# EAGLE design Minimal (EAGLE 9.4.2)

## Sheet 1 of 2
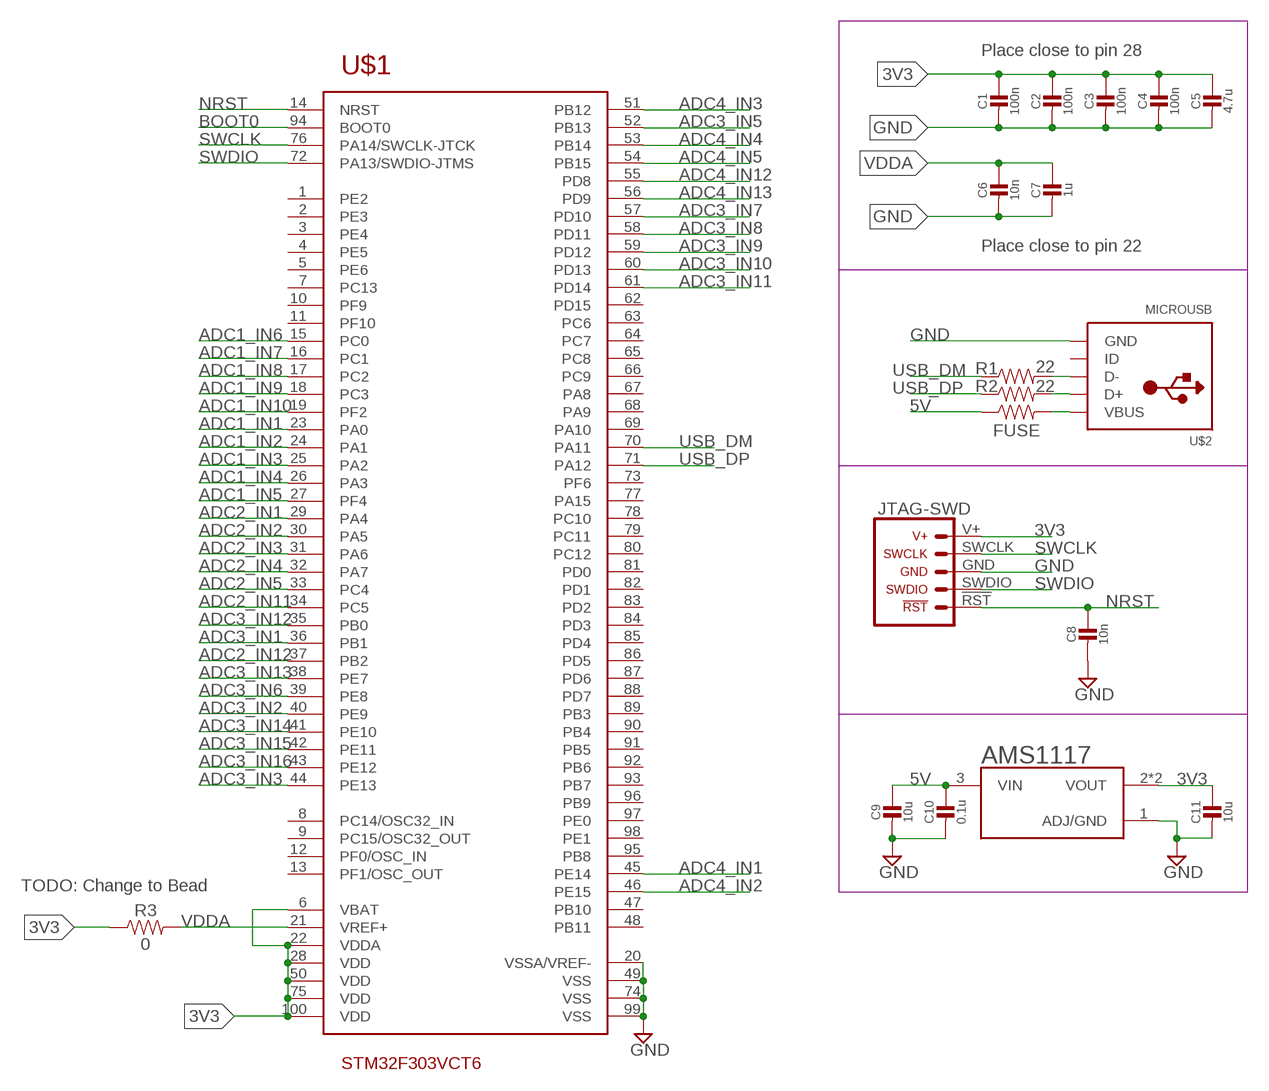
[diagram p0: schematic, sheet 1]

### Parts
AMS1117  3.3V  VREG_AMS1117SMALL  [SOT89]
C1  100n  CAP_CERAMIC_0603  [CAP_0603]
C2  100n  CAP_CERAMIC_0603  [CAP_0603]
C3  100n  CAP_CERAMIC_0603  [CAP_0603]
C4  100n  CAP_CERAMIC_0603  [CAP_0603]
C5  4.7u  CAP_CERAMIC_0603  [CAP_0603]
C6  10n  CAP_CERAMIC_0603  [CAP_0603]
C7  1u  CAP_CERAMIC_0603  [CAP_0603]
C8  10n  CAP_CERAMIC_0603  [CAP_0603]
C9  10u  CAP_CERAMIC_0603  [CAP_0603]
C10  0.1u  CAP_CERAMIC_0603  [CAP_0603]
C11  10u  CAP_CERAMIC_0603  [CAP_0603]
FUSE  RESISTOR1206  [1206]
R1  22  RESISTOR0603  [0603]
R2  22  RESISTOR0603  [0603]
R3  0  RESISTOR0603  [0603]
U$1  STM32F303VCT6  [LQFP-100]
U$2  MICROUSB  [MICROUSB]
U$3  JTAG-SWD  [JTAG_SWD]

### Nets
3V3: AMS1117.2(VOUT) AMS1117.2@1(VOUT) C1.1 C2.1 C3.1 C4.1 C5.1 C11.1 R3.1 U$1.6(VBAT) U$1.22(VDDA) U$1.28(VDD) U$1.50(VDD) U$1.75(VDD) U$1.100(VDD) U$3.V+
5V: AMS1117.3(VIN) C9.1 C10.1 FUSE.1
ADC1_IN1: U$1.23(PA0) ; also sheet 2
ADC1_IN2: U$1.24(PA1) ; also sheet 2
ADC1_IN3: U$1.25(PA2) ; also sheet 2
ADC1_IN4: U$1.26(PA3) ; also sheet 2
ADC1_IN5: U$1.27(PF4) ; also sheet 2
ADC1_IN6: U$1.15(PC0) ; also sheet 2
ADC1_IN7: U$1.16(PC1) ; also sheet 2
ADC1_IN8: U$1.17(PC2) ; also sheet 2
ADC1_IN9: U$1.18(PC3) ; also sheet 2
ADC1_IN10: U$1.19(PF2) ; also sheet 2
ADC2_IN1: U$1.29(PA4) ; also sheet 2
ADC2_IN2: U$1.30(PA5) ; also sheet 2
ADC2_IN3: U$1.31(PA6) ; also sheet 2
ADC2_IN4: U$1.32(PA7) ; also sheet 2
ADC2_IN5: U$1.33(PC4) ; also sheet 2
ADC2_IN11: U$1.34(PC5) ; also sheet 2
ADC2_IN12: U$1.37(PB2) ; also sheet 2
ADC3_IN1: U$1.36(PB1) ; also sheet 2
ADC3_IN2: U$1.40(PE9) ; also sheet 2
ADC3_IN3: U$1.44(PE13) ; also sheet 2
ADC3_IN5: U$1.52(PB13) ; also sheet 2
ADC3_IN6: U$1.39(PE8) ; also sheet 2
ADC3_IN7: U$1.57(PD10) ; also sheet 2
ADC3_IN8: U$1.58(PD11) ; also sheet 2
ADC3_IN9: U$1.59(PD12) ; also sheet 2
ADC3_IN10: U$1.60(PD13) ; also sheet 2
ADC3_IN11: U$1.61(PD14) ; also sheet 2
ADC3_IN12: U$1.35(PB0) ; also sheet 2
ADC3_IN13: U$1.38(PE7) ; also sheet 2
ADC3_IN14: U$1.41(PE10) ; also sheet 2
ADC3_IN15: U$1.42(PE11) ; also sheet 2
ADC3_IN16: U$1.43(PE12) ; also sheet 2
ADC4_IN1: U$1.45(PE14) ; also sheet 2
ADC4_IN2: U$1.46(PE15) ; also sheet 2
ADC4_IN3: U$1.51(PB12) ; also sheet 2
ADC4_IN4: U$1.53(PB14) ; also sheet 2
ADC4_IN5: U$1.54(PB15) ; also sheet 2
ADC4_IN12: U$1.55(PD8) ; also sheet 2
ADC4_IN13: U$1.56(PD9) ; also sheet 2
BOOT0: U$1.94(BOOT0)
GND: AMS1117.1(ADJ/GND) C1.2 C2.2 C3.2 C4.2 C5.2 C6.2 C7.2 C8.2 C9.2 C10.2 C11.2 U$1.20(VSSA/VREF-) U$1.49(VSS) U$1.74(VSS) U$1.99(VSS) U$2.GND U$2.S1(GND) U$2.S2(GND) U$2.S3(GND) U$2.S4(GND) U$2.S5(GND) U$2.S6(GND) U$3.GND
N$1: FUSE.2 U$2.VBUS
N$2: R2.2 U$2.D+
N$3: R1.2 U$2.D-
NRST: C8.1 U$1.14(NRST) U$3.!RST
SWCLK: U$1.76(PA14/SWCLK-JTCK) U$3.SWCLK
SWDIO: U$1.72(PA13/SWDIO-JTMS) U$3.SWDIO
USB_DM: R1.1 U$1.70(PA11)
USB_DP: R2.1 U$1.71(PA12)
VDDA: C6.1 C7.1 R3.2 U$1.21(VREF+)
Unconnected: U$1.1(PE2) U$1.2(PE3) U$1.3(PE4) U$1.4(PE5) U$1.5(PE6) U$1.7(PC13) U$1.8(PC14/OSC32_IN) U$1.9(PC15/OSC32_OUT) U$1.10(PF9) U$1.11(PF10) U$1.12(PF0/OSC_IN) U$1.13(PF1/OSC_OUT) U$1.47(PB10) U$1.48(PB11) U$1.62(PD15) U$1.63(PC6) U$1.64(PC7) U$1.65(PC8) U$1.66(PC9) U$1.67(PA8) U$1.68(PA9) U$1.69(PA10) U$1.73(PF6) U$1.77(PA15) U$1.78(PC10) U$1.79(PC11) U$1.80(PC12) U$1.81(PD0) U$1.82(PD1) U$1.83(PD2) U$1.84(PD3) U$1.85(PD4) U$1.86(PD5) U$1.87(PD6) U$1.88(PD7) U$1.89(PB3) U$1.90(PB4) U$1.91(PB5) U$1.92(PB6) U$1.93(PB7) U$1.95(PB8) U$1.96(PB9) U$1.97(PE0) U$1.98(PE1) U$2.ID

### Notes on the sheet
- Place close to pin 28
- Place close to pin 22
- TODO: Change to Bead

## Sheet 2 of 2
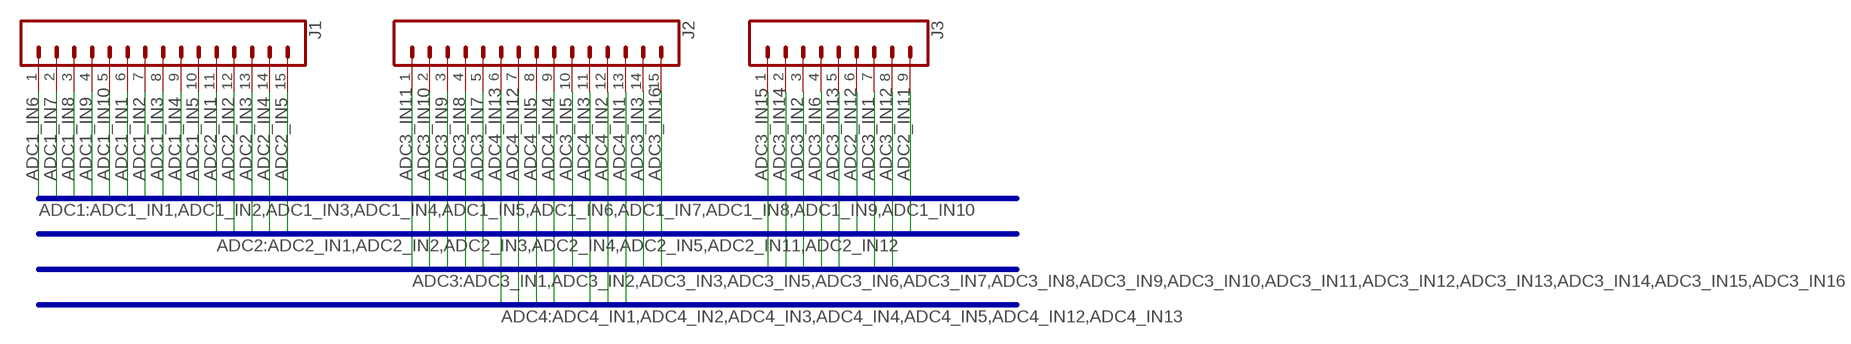
[diagram p1: schematic, sheet 2]

### Parts
J1  CONN_15  [1X15]
J2  CONN_15  [1X15]
J3  CONN_09  [1X09]

### Nets
ADC1_IN1: J1.6 ; also sheet 1
ADC1_IN2: J1.7 ; also sheet 1
ADC1_IN3: J1.8 ; also sheet 1
ADC1_IN4: J1.9 ; also sheet 1
ADC1_IN5: J1.10 ; also sheet 1
ADC1_IN6: J1.1 ; also sheet 1
ADC1_IN7: J1.2 ; also sheet 1
ADC1_IN8: J1.3 ; also sheet 1
ADC1_IN9: J1.4 ; also sheet 1
ADC1_IN10: J1.5 ; also sheet 1
ADC2_IN1: J1.11 ; also sheet 1
ADC2_IN2: J1.12 ; also sheet 1
ADC2_IN3: J1.13 ; also sheet 1
ADC2_IN4: J1.14 ; also sheet 1
ADC2_IN5: J1.15 ; also sheet 1
ADC2_IN11: J3.9 ; also sheet 1
ADC2_IN12: J3.6 ; also sheet 1
ADC3_IN1: J3.7 ; also sheet 1
ADC3_IN2: J3.3 ; also sheet 1
ADC3_IN3: J2.14 ; also sheet 1
ADC3_IN5: J2.10 ; also sheet 1
ADC3_IN6: J3.4 ; also sheet 1
ADC3_IN7: J2.5 ; also sheet 1
ADC3_IN8: J2.4 ; also sheet 1
ADC3_IN9: J2.3 ; also sheet 1
ADC3_IN10: J2.2 ; also sheet 1
ADC3_IN11: J2.1 ; also sheet 1
ADC3_IN12: J3.8 ; also sheet 1
ADC3_IN13: J3.5 ; also sheet 1
ADC3_IN14: J3.2 ; also sheet 1
ADC3_IN15: J3.1 ; also sheet 1
ADC3_IN16: J2.15 ; also sheet 1
ADC4_IN1: J2.13 ; also sheet 1
ADC4_IN2: J2.12 ; also sheet 1
ADC4_IN3: J2.11 ; also sheet 1
ADC4_IN4: J2.9 ; also sheet 1
ADC4_IN5: J2.8 ; also sheet 1
ADC4_IN12: J2.7 ; also sheet 1
ADC4_IN13: J2.6 ; also sheet 1

### Buses
ADC1:ADC1_IN1,ADC1_IN2,ADC1_IN3,ADC1_IN4,ADC1_IN5,ADC1_IN6,ADC1_IN7,ADC1_IN8,ADC1_IN9,ADC1_IN10
ADC2:ADC2_IN1,ADC2_IN2,ADC2_IN3,ADC2_IN4,ADC2_IN5,ADC2_IN11,ADC2_IN12
ADC3:ADC3_IN1,ADC3_IN2,ADC3_IN3,ADC3_IN5,ADC3_IN6,ADC3_IN7,ADC3_IN8,ADC3_IN9,ADC3_IN10,ADC3_IN11,ADC3_IN12,ADC3_IN13,ADC3_IN14,ADC3_IN15,ADC3_IN16
ADC4:ADC4_IN1,ADC4_IN2,ADC4_IN3,ADC4_IN4,ADC4_IN5,ADC4_IN12,ADC4_IN13

## Library data of the parts
AMS1117 = Scott-ICs:VREG_AMS1117: 1-Amp Low Drop Out Voltage Regulatator
C1-C11 = Scott-Electrical:CAP_CERAMIC
FUSE R1-R3 = Scott-Electrical:RESISTOR: Generic Resistor Package
J1 J2 = SparkFun-Connectors:CONN_15: Multi connection point. Often used as Generic Header-pin footprint for 0.1 inch spaced/style header connections On any of the 0.1 inch spaced packages, you can populate with these: Break Away Headers - Straight <https://www.sparkfun.com/products/116> (PRT-00116) Break Away Male Headers - Right Angle <https://www.sparkfun.com/products/553> (PRT-00553) Female Headers <https://www.sparkfun.com/products/115> (PRT-00115) Break Away Headers - Machine Pin <https://www.sparkfun.com/products/117> (PRT-00117) Break Away Female Headers - Swiss Machine Pin <https://www.sparkfun.com/products/743> (PRT-00743) For SCREWTERMINALS and SPRING TERMINALS visit here: Screw Terimnals on SparkFun.com <https://www.sparkfun.com/search/results?term=Screw+Terminals> (5mm/3.5mm/2.54mm spacing) This device is also useful as a general connection point to wire up your design to another part of your project. Our various solder wires solder well into these plated through hole pads. Hook-Up Wire - Assortment (Stranded, 22 AWG) <https://www.sparkfun.com/products/11375> (PRT-11375) Hook-Up Wire - Assortment (Solid Core, 22 AWG) <https://www.sparkfun.com/products/11367> (PRT-11367) View the entire wire category on our website here <https://www.sparkfun.com/categories/141> Special notes: Molex polarized connector foot print use with SKU : PRT-08231 with associated crimp pins and housings. 1MM SMD Version SKU: PRT-10208 NOTES ON THE VARIANTS LOCK and LOCK_LONGPADS... This footprint was designed to help hold the alignment of a through-hole component (i.e. 6-pin header) while soldering it into place. You may notice that each hole has been shifted either up or down by 0.005 of an inch from it's more standard position (which is a perfectly straight line). This slight alteration caused the pins (the squares in the middle) to touch the edges of the holes. Because they are alternating, it causes a "brace" to hold the component in place. 0.005 has proven to be the perfect amount of "off-center" position when using our standard breakaway headers. Although looks a little odd when you look at the bare footprint, once you have a header in there, the alteration is very hard to notice. Also,if you push a header all the way into place, it is covered up entirely on the bottom side.
J3 = SparkFun-Connectors:CONN_09: Multi connection point. Often used as Generic Header-pin footprint for 0.1 inch spaced/style header connections On any of the 0.1 inch spaced packages, you can populate with these: Break Away Headers - Straight <https://www.sparkfun.com/products/116> (PRT-00116) Break Away Male Headers - Right Angle <https://www.sparkfun.com/products/553> (PRT-00553) Female Headers <https://www.sparkfun.com/products/115> (PRT-00115) Break Away Headers - Machine Pin <https://www.sparkfun.com/products/117> (PRT-00117) Break Away Female Headers - Swiss Machine Pin <https://www.sparkfun.com/products/743> (PRT-00743) For SCREWTERMINALS and SPRING TERMINALS visit here: Screw Terimnals on SparkFun.com <https://www.sparkfun.com/search/results?term=Screw+Terminals> (5mm/3.5mm/2.54mm spacing) This device is also useful as a general connection point to wire up your design to another part of your project. Our various solder wires solder well into these plated through hole pads. Hook-Up Wire - Assortment (Stranded, 22 AWG) <https://www.sparkfun.com/products/11375> (PRT-11375) Hook-Up Wire - Assortment (Solid Core, 22 AWG) <https://www.sparkfun.com/products/11367> (PRT-11367) View the entire wire category on our website here <https://www.sparkfun.com/categories/141> Special notes: Molex polarized connector foot print use with SKU : PRT-08231 with associated crimp pins and housings. 1MM SMD Version SKU: PRT-10208 NOTES ON THE VARIANTS LOCK and LOCK_LONGPADS... This footprint was designed to help hold the alignment of a through-hole component (i.e. 6-pin header) while soldering it into place. You may notice that each hole has been shifted either up or down by 0.005 of an inch from it's more standard position (which is a perfectly straight line). This slight alteration caused the pins (the squares in the middle) to touch the edges of the holes. Because they are alternating, it causes a "brace" to hold the component in place. 0.005 has proven to be the perfect amount of "off-center" position when using our standard breakaway headers. Although looks a little odd when you look at the bare footprint, once you have a header in there, the alteration is very hard to notice. Also,if you push a header all the way into place, it is covered up entirely on the bottom side.
U$1 = Scott-MCU:STM32F303VCT6
U$2 = Scott-Connectors:MICROUSB
U$3 = Scott-Connectors:JTAG-SWD

## Board
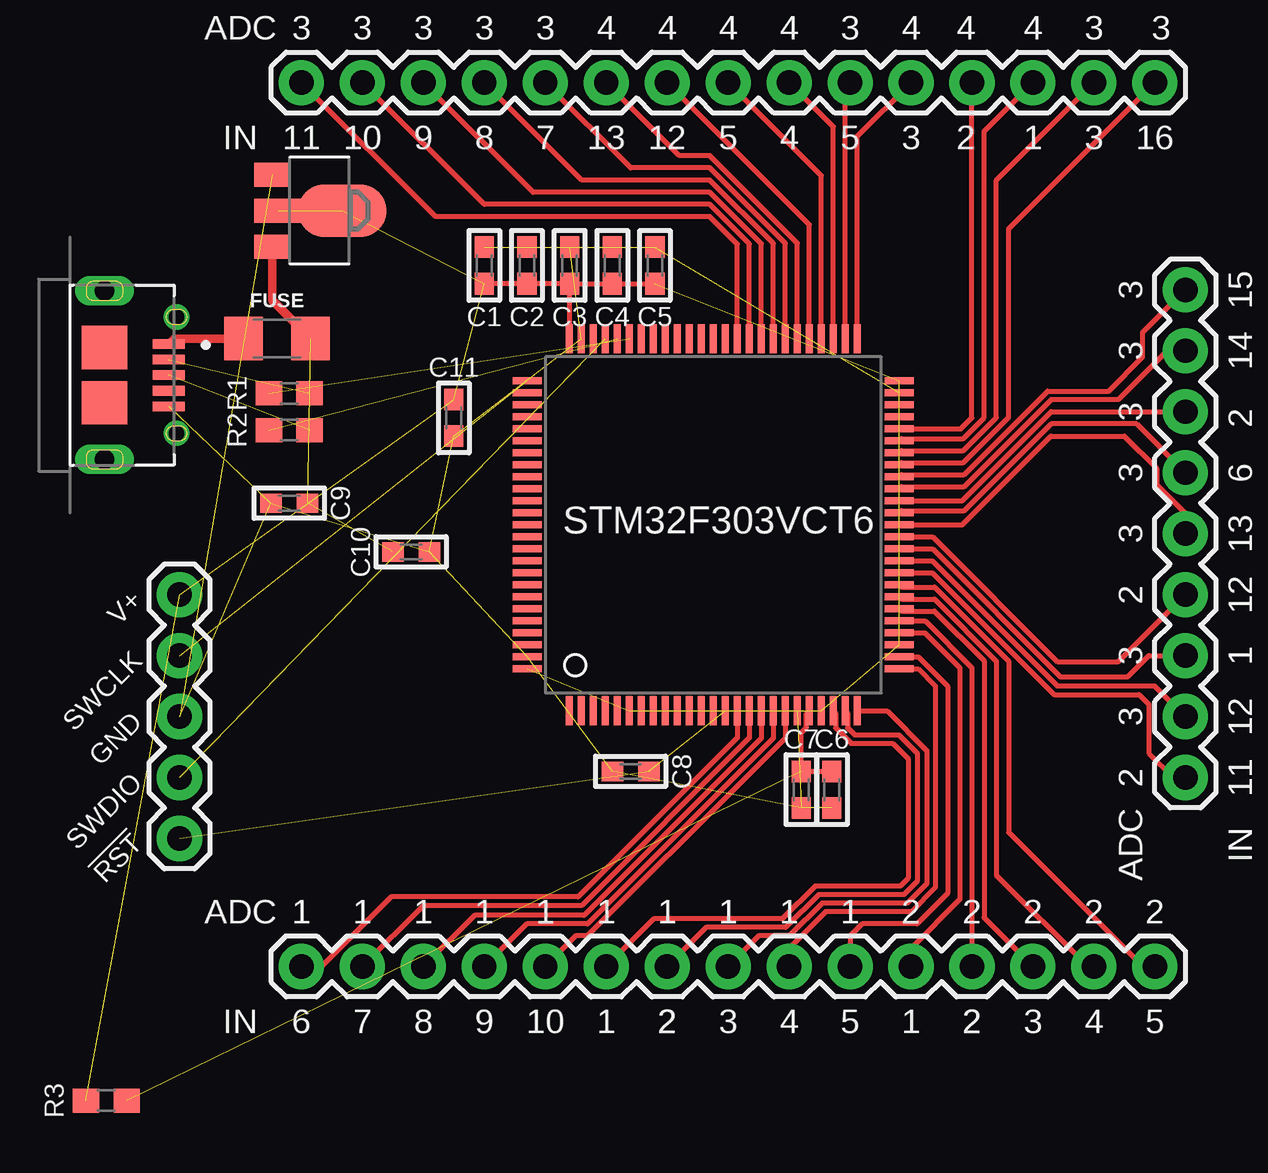
[diagram p2: board, top side]

No outline drawn. Coordinates in mm, seen from the top.
Copper layers (1*16): Top 0.035559375mm / dielectric 1.6mm / Bottom 0.035559375mm
Design rules "jlcpcb2layer": minimum track width 5mil, minimum drill 12mil, track to track 5mil, track to pad 5mil, pad to pad 5mil, via to via 5mil, smd to smd 5mil, copper to edge 8mil, drill to drill 6mil, minimum pad ring 5mil, minimum via ring 3mil, stop-mask expansion 2.5mil, vias tented up to drill 20mil, thermal gap 10mil

### Footprints (pad centres in the part's own frame; a part is rotated, then mirrored left to right if it is on the bottom)
SOT89 = smd 1 x 1.5: 1 -1.499,-1.981; 3 1.499,-1.981 | smd 1 x 2: 2 0,-1.727 | smd 2.2 x 3.7: 2@1 0,0.94
CAP_0603 = smd 0.9 x 0.8: 1 -0.762,0; 2 0.762,0
1206 = smd 1.6 x 1.8: 1 -1.4,0; 2 1.4,0
1X15 = drill 1.016 pad 1.88: 1 0,0; 2 2.54,0; 3 5.08,0; 4 7.62,0; 5 10.16,0; 6 12.7,0; 7 15.24,0; 8 17.78,0; 9 20.32,0; 10 22.86,0; 11 25.4,0; 12 27.94,0; 13 30.48,0; 14 33.02,0; 15 35.56,0
1X09 = drill 1.016 pad 1.88: 1 0,0; 2 2.54,0; 3 5.08,0; 4 7.62,0; 5 10.16,0; 6 12.7,0; 7 15.24,0; 8 17.78,0; 9 20.32,0
0603 = smd 1.1 x 1: 1 -0.85,0; 2 0.85,0
LQFP-100 = smd 0.3 x 1.2: 1 1,-14.75; 2 1.5,-14.75; 3 2,-14.75; 4 2.5,-14.75; 5 3,-14.75; 6 3.5,-14.75; 7 4,-14.75; 8 4.5,-14.75; 9 5,-14.75; 10 5.5,-14.75; 11 6,-14.75; 12 6.5,-14.75; 13 7,-14.75; 14 7.5,-14.75; 15 8,-14.75; 16 8.5,-14.75; 17 9,-14.75; 18 9.5,-14.75; 19 10,-14.75; 20 10.5,-14.75; 21 11,-14.75; 22 11.5,-14.75; 23 12,-14.75; 24 12.5,-14.75; 25 13,-14.75; 51 13,0.75; 52 12.5,0.75; 53 12,0.75; 54 11.5,0.75; 55 11,0.75; 56 10.5,0.75; 57 10,0.75; 58 9.5,0.75; 59 9,0.75; 60 8.5,0.75; 61 8,0.75; 62 7.5,0.75; 63 7,0.75; 64 6.5,0.75; 65 6,0.75; 66 5.5,0.75; 67 5,0.75; 68 4.5,0.75; 69 4,0.75; 70 3.5,0.75; 71 3,0.75; 72 2.5,0.75; 73 2,0.75; 74 1.5,0.75; 75 1,0.75 | smd 1.2 x 0.3: 26 14.75,-13; 27 14.75,-12.5; 28 14.75,-12; 29 14.75,-11.5; 30 14.75,-11; 31 14.75,-10.5; 32 14.75,-10; 33 14.75,-9.5; 34 14.75,-9; 35 14.75,-8.5; 36 14.75,-8; 37 14.75,-7.5; 38 14.75,-7; 39 14.75,-6.5; 40 14.75,-6; 41 14.75,-5.5; 42 14.75,-5; 43 14.75,-4.5; 44 14.75,-4; 45 14.75,-3.5; 46 14.75,-3; 47 14.75,-2.5; 48 14.75,-2; 49 14.75,-1.5; 50 14.75,-1; 76 -0.75,-1; 77 -0.75,-1.5; 78 -0.75,-2; 79 -0.75,-2.5; 80 -0.75,-3; 81 -0.75,-3.5; 82 -0.75,-4; 83 -0.75,-4.5; 84 -0.75,-5; 85 -0.75,-5.5; 86 -0.75,-6; 87 -0.75,-6.5; 88 -0.75,-7; 89 -0.75,-7.5; 90 -0.75,-8; 91 -0.75,-8.5; 92 -0.75,-9; 93 -0.75,-9.5; 94 -0.75,-10; 95 -0.75,-10.5; 96 -0.75,-11; 97 -0.75,-11.5; 98 -0.75,-12; 99 -0.75,-12.5; 100 -0.75,-13
MICROUSB = smd 0.4 x 1.35: D+ 0,2.6; D- -0.65,2.6; GND 1.3,2.6; ID 0.65,2.6; VBUS -1.3,2.6 | drill 0.65 pad 1.05: S1 -2.425,2.925; S2 2.425,2.925 | drill 0.825 pad 0.95 long: S3 -3.513,-0.075; S6 3.513,-0.075 | smd 1.8 x 1.9: S4 -1.15,-0.075; S5 1.15,-0.075
JTAG_SWD = drill 1.016 pad 1.88: !RST 0,-10.16; GND 0,-5.08; SWCLK 0,-2.54; SWDIO 0,-7.62; V+ 0,0

### Placement (x,y rotation side)
AMS1117  -3.05,25.15 270 top
C1  3.81,22.86 90 top
C2  5.59,22.86 90 top
C3  7.37,22.86 90 top
C4  9.14,22.86 90 top
C5  10.92,22.86 90 top
C6  18.29,1.02 270 top
C7  17.02,1.02 270 top
C8  9.91,1.78 180 top
C9  -4.32,12.95 180 top
C10  0.76,10.92 0 top
C11  2.54,16.51 270 top
FUSE  -4.83,19.81 180 top
J1  -3.81,-6.35 0 top
J2  -3.81,30.48 0 top
J3  33.02,21.84 270 top
R1  -4.32,17.53 0 top
R2  -4.32,16 0 top
R3  -11.94,-11.94 0 top
U$1  6.35,19.05 0 top
U$2  -11.94,18.29 270 top
U$3  -8.89,9.14 0 top

### Tracks (layer width: path | path; a pad name or v marks a point on that pad's centre or on a via)
3V3  (10 unrouted)
  Top 0.203: U$1.75 7.37,19.82 C3.1 | C3.1 C4.1 C5.1 | C3.1 C2.1 C1.1
5V  (2 unrouted)
  Top 0.356: FUSE.1 -5.03,21.41 AMS1117.3
ADC1_IN1
  Top 0.203: U$1.23 18.45,4.2 18.45,3.59 19.09,2.95 20.83,2.95 21.47,2.31 21.47,-2.67 21.14,-3 17.59,-3 16.22,-4.37 10.87,-4.37 J1.6
ADC1_IN2
  Top 0.203: U$1.24 18.95,4.2 18.95,3.6 19.24,3.3 21.08,3.3 21.84,2.54 21.84,-2.8 21.29,-3.35 17.74,-3.35 16.37,-4.72 13.06,-4.72 J1.7
ADC1_IN3
  Top 0.203: U$1.25 20.59,4.3 22.25,2.64 22.25,-2.9 21.44,-3.71 17.89,-3.71 16.52,-5.08 15.24,-5.08 J1.8
ADC1_IN4
  Top 0.203: U$1.26 21.89,6.05 22.61,5.33 22.61,-3.05 21.59,-4.06 18.03,-4.06 16.51,-5.59 J1.9
ADC1_IN5
  Top 0.203: U$1.27 21.9,6.55 23.11,5.33 23.11,-3.3 21.84,-4.57 19.56,-4.57 19.05,-5.08 J1.10
ADC1_IN6
  Top 0.203: U$1.15 14.35,3.17 7.72,-3.45 -0.06,-3.45 -2.96,-6.35 J1.1
ADC1_IN7
  Top 0.203: U$1.16 14.85,3.17 7.87,-3.81 1.27,-3.81 J1.2
ADC1_IN8
  Top 0.203: U$1.17 15.35,3.17 7.96,-4.22 3.4,-4.22 J1.3
ADC1_IN9
  Top 0.203: U$1.18 15.85,3.17 8.11,-4.57 5.59,-4.57 J1.4
ADC1_IN10
  Top 0.203: U$1.19 16.35,3.16 14.98,1.79 14.85,1.66 8.11,-5.08 7.62,-5.08 J1.5
ADC2_IN1
  Top 0.203: U$1.29 22.17,7.55 23.62,6.1 23.62,-3.56 21.59,-5.59 J1.11
ADC2_IN2
  Top 0.203: U$1.30 22.18,8.05 24.13,6.1 J1.12
ADC2_IN3
  Top 0.203: U$1.31 21.2,8.45 22.57,8.45 24.64,6.38 24.64,-4.32 J1.13
ADC2_IN4
  Top 0.203: U$1.32 21.2,8.95 22.57,8.95 25.15,6.38 25.15,-2.54 28.96,-6.35 J1.14
ADC2_IN5
  Top 0.203: U$1.33 21.2,9.45 22.57,9.45 25.65,6.37 25.65,-0.76 31.24,-6.35 J1.15
ADC2_IN11
  Top 0.203: U$1.34 22.48,10.05 27.55,4.98 31.09,4.98 31.5,4.57 31.5,2.54 32.51,1.52 J3.9
ADC2_IN12
  Top 0.203: U$1.37 22.49,11.55 27.69,6.35 30.23,6.35 J3.6
ADC3_IN1
  Top 0.203: U$1.36 22.49,11.05 27.82,5.72 30.61,5.72 31.5,6.6 J3.7
ADC3_IN2
  Top 0.203: U$1.40 23.72,13.05 27.43,16.76 J3.3
ADC3_IN3
  Top 0.203: U$1.44 21.2,15.15 23.77,15.15 25.15,16.52 25.15,26.42 J2.14
ADC3_IN5
  Top 0.203: U$1.52 18.85,30.28 J2.10
ADC3_IN6
  Top 0.203: U$1.39 21.2,12.65 23.82,12.65 27.43,16.26 30.99,16.26 J3.4
ADC3_IN7
  Top 0.203: U$1.57 16.35,23.78 13.21,26.92 9.91,26.92 J2.5
ADC3_IN8
  Top 0.203: U$1.58 15.85,23.77 13.21,26.42 7.87,26.42 J2.4
ADC3_IN9
  Top 0.203: U$1.59 15.35,23.77 13.21,25.91 5.84,25.91 J2.3
ADC3_IN10
  Top 0.203: U$1.60 14.85,23.76 13.21,25.4 3.81,25.4 J2.2
ADC3_IN11
  Top 0.203: U$1.61 14.35,23.75 13.21,24.89 1.78,24.89 J2.1
ADC3_IN12
  Top 0.203: U$1.35 22.48,10.55 27.7,5.33 31.75,5.33 J3.8
ADC3_IN13
  Top 0.203: U$1.38 23.72,12.05 27.42,15.75 30.48,15.75 31.83,14.4 31.83,13.73 33.02,12.54 J3.5
ADC3_IN14
  Top 0.203: U$1.41 21.2,13.65 23.81,13.65 27.43,17.27 30.23,17.27 32.26,19.3 J3.2
ADC3_IN15
  Top 0.203: U$1.42 21.2,14.15 23.8,14.15 27.29,17.63 29.82,17.63 31.24,19.05 31.24,20.07 J3.1
ADC3_IN16
  Top 0.203: U$1.43 21.2,14.65 23.77,14.65 25.65,16.52 25.65,24.38 J2.15
ADC4_IN1
  Top 0.203: U$1.45 21.2,15.65 23.77,15.65 24.64,16.52 24.64,28.45 J2.13
ADC4_IN2
  Top 0.203: U$1.46 23.67,16.05 24.13,16.51 J2.12
ADC4_IN3
  Top 0.203: U$1.51 19.35,28.24 J2.11
ADC4_IN4
  Top 0.203: U$1.53 18.35,28.64 J2.9
ADC4_IN5
  Top 0.203: U$1.54 17.85,26.6 J2.8
ADC4_IN12
  Top 0.203: U$1.55 17.35,24.56 J2.7
ADC4_IN13
  Top 0.203: U$1.56 16.85,23.79 13.21,27.43 11.94,27.43 J2.6
GND  (17 unrouted)
N$1
  Top 0.356: U$2.VBUS -9.11,19.81 FUSE.2
N$2  (1 unrouted)
N$3  (1 unrouted)
NRST  (2 unrouted)
SWCLK  (1 unrouted)
SWDIO  (1 unrouted)
USB_DM  (1 unrouted)
USB_DP  (1 unrouted)
VDDA  (1 unrouted)
  Top 0.203: U$1.21 17.23,4.18 17.23,3.6 17.02,3.4 C7.1 C6.1

### Text on the board
tPlace: ADC | 3 | 3 | 3 | 3 | 3 | 4 | 4 | 4 | 4 | 3 | 4 | 4 | 4 | 3 | 3 | IN | 11 | 10 | 9 | 8 | 7 | 13 | 12 | 5 | 4 | 5 | 3 | 2 | 1 | 3 | 16 | 3 | 15 | 3 | 14 | 3 | 2 | 3 | 6 | 3 | 13 | 2 | 12 | 3 | 1 | 3 | 12 | 2 | 11 | ADC | IN | ADC | 1 | 1 | 1 | 1 | 1 | 1 | 1 | 1 | 1 | 1 | 2 | 2 | 2 | 2 | 2 | IN | 6 | 7 | 8 | 9 | 10 | 1 | 2 | 2 | 3 | 4 | 5 | 1 | 2 | 2 | 3 | 4 | 5